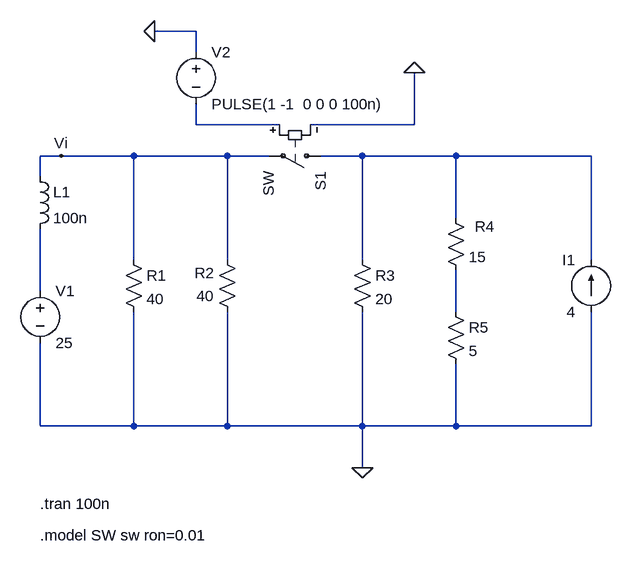
[diagram p0: schematic Circuit.asc]
Circuit.asc, the LTspice schematic file:
Version 4
SHEET 1 900 680
WIRE 64 -192 0 -192
WIRE 64 -160 64 -192
WIRE 64 -48 64 -80
WIRE 192 -48 64 -48
WIRE 400 -48 400 -128
WIRE 400 -48 240 -48
WIRE -144 0 -176 0
WIRE -32 0 -144 0
WIRE 112 0 -32 0
WIRE 176 0 112 0
WIRE 320 0 256 0
WIRE 464 0 320 0
WIRE 672 0 464 0
WIRE -176 32 -176 0
WIRE 464 96 464 0
WIRE -32 160 -32 0
WIRE 112 160 112 0
WIRE 320 160 320 0
WIRE 672 160 672 0
WIRE -176 208 -176 112
WIRE 464 240 464 176
WIRE -176 416 -176 288
WIRE -32 416 -32 240
WIRE -32 416 -176 416
WIRE 112 416 112 240
WIRE 112 416 -32 416
WIRE 320 416 320 240
WIRE 320 416 112 416
WIRE 464 416 464 320
WIRE 464 416 320 416
WIRE 672 416 672 240
WIRE 672 416 464 416
WIRE 320 480 320 416
FLAG 320 480 0
FLAG 0 -192 0
FLAG 400 -128 0
FLAG -144 0 Vi
SYMBOL voltage -176 192 R0
SYMATTR InstName V1
SYMATTR Value 25
SYMBOL voltage 64 -176 R0
WINDOW 123 0 0 Left 0
WINDOW 39 0 0 Left 0
SYMATTR InstName V2
SYMATTR Value PULSE(1 -1  0 0 0 100n)
SYMBOL res -48 144 R0
SYMATTR InstName R1
SYMATTR Value 40
SYMBOL res 128 256 R180
WINDOW 0 36 76 Left 2
WINDOW 3 36 40 Left 2
SYMATTR InstName R2
SYMATTR Value 40
SYMBOL res 304 144 R0
SYMATTR InstName R3
SYMATTR Value 20
SYMBOL res 448 80 R0
WINDOW 0 45 29 Left 2
SYMATTR InstName R4
SYMATTR Value 15
SYMBOL sw 272 0 R90
SYMATTR InstName S1
SYMBOL current 672 240 R180
WINDOW 0 24 80 Left 2
WINDOW 3 24 0 Left 2
WINDOW 123 0 0 Left 0
WINDOW 39 0 0 Left 0
SYMATTR InstName I1
SYMATTR Value 4
SYMBOL ind -192 16 R0
SYMATTR InstName L1
SYMATTR Value 100n
SYMBOL res 448 224 R0
SYMATTR InstName R5
SYMATTR Value 5
TEXT -176 584 Left 2 !.model SW sw ron=0.01
TEXT -176 536 Left 2 !.tran 100n

The netlist it stands for:
* Circuit.asc
V1 N003 0 25
V2 0 N001 PULSE(1 -1  0 0 0 100n)
R1 Vi 0 40
R2 0 Vi 40
R3 N002 0 20
R4 N002 N004 15
S1 N002 Vi N001 0 SW
I1 0 N002 4
L1 Vi N003 100n
R5 N004 0 5
.model SW sw ron=0.01
.tran 100n
.backanno
.end